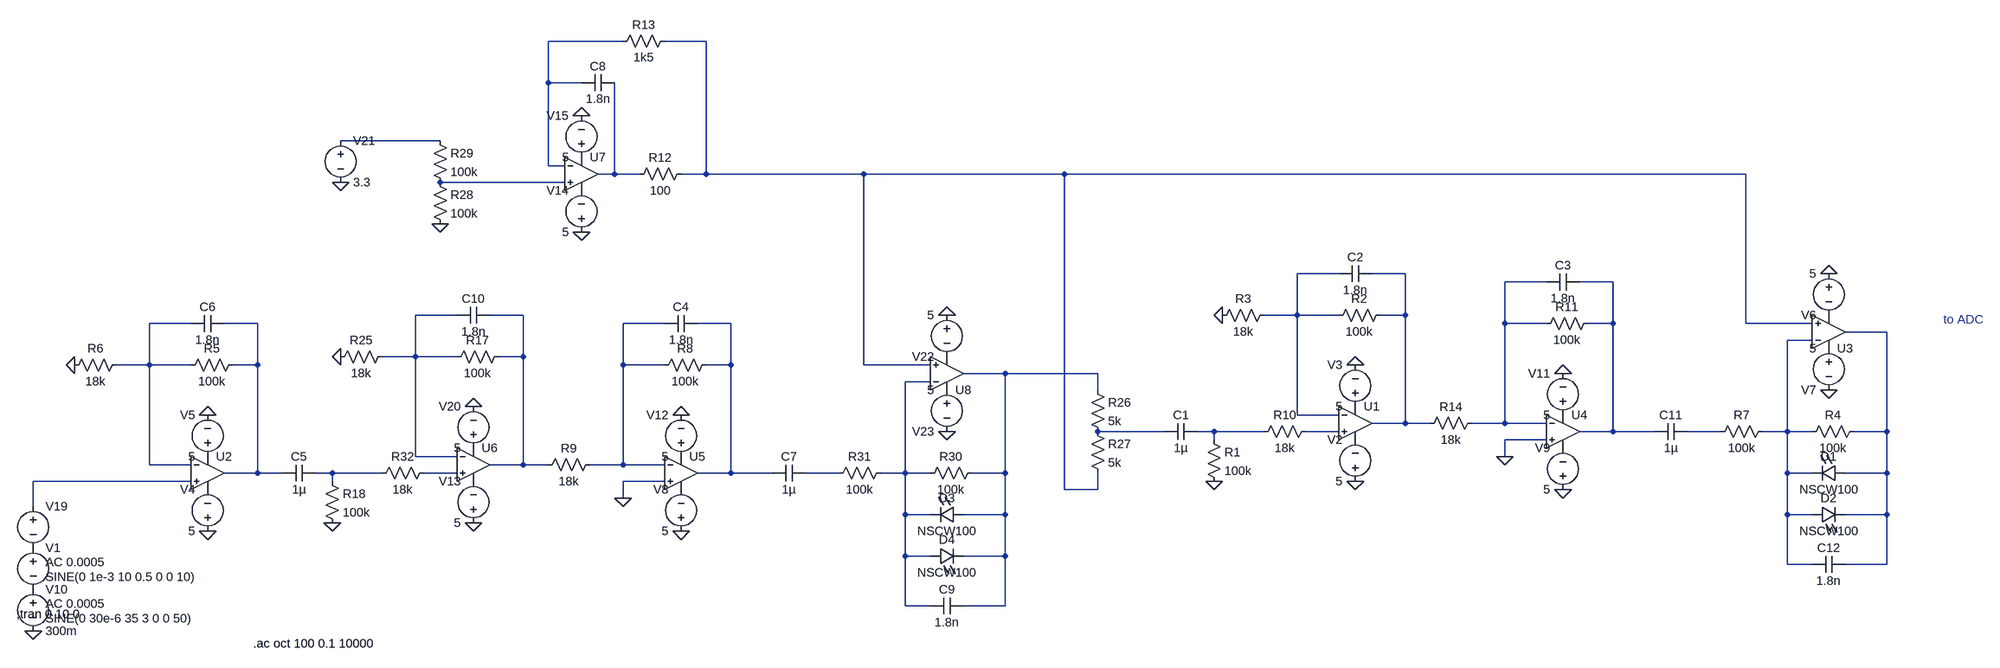
[diagram p0: schematic motion_sensor_v8.asc]
motion_sensor_v8.asc, the LTspice schematic file:
Version 4
SHEET 1 3732 1012
WIRE -480 -1072 -624 -1072
WIRE -320 -1072 -400 -1072
WIRE -624 -992 -624 -1072
WIRE -560 -992 -624 -992
WIRE -832 -880 -1024 -880
WIRE -624 -832 -624 -992
WIRE -592 -832 -624 -832
WIRE -496 -816 -496 -992
WIRE -496 -816 -528 -816
WIRE -448 -816 -496 -816
WIRE -320 -816 -320 -1072
WIRE -320 -816 -368 -816
WIRE -16 -816 -320 -816
WIRE 384 -816 -16 -816
WIRE 1696 -816 384 -816
WIRE -592 -800 -832 -800
WIRE 912 -624 832 -624
WIRE 1040 -624 976 -624
WIRE 1312 -608 1232 -608
WIRE 1440 -608 1376 -608
WIRE -800 -544 -880 -544
WIRE -672 -544 -736 -544
WIRE 832 -544 832 -624
WIRE 832 -544 768 -544
WIRE 912 -544 832 -544
WIRE 1040 -544 1040 -624
WIRE 1040 -544 992 -544
WIRE -1312 -528 -1392 -528
WIRE -1184 -528 -1248 -528
WIRE -400 -528 -480 -528
WIRE -272 -528 -336 -528
WIRE 1232 -528 1232 -608
WIRE 1312 -528 1232 -528
WIRE 1440 -528 1440 -608
WIRE 1440 -528 1392 -528
WIRE 1696 -528 1696 -816
WIRE 1824 -528 1696 -528
WIRE 1968 -512 1888 -512
WIRE 1824 -496 1776 -496
WIRE -880 -464 -880 -544
WIRE -880 -464 -944 -464
WIRE -800 -464 -880 -464
WIRE -672 -464 -672 -544
WIRE -672 -464 -720 -464
WIRE -1392 -448 -1392 -528
WIRE -1392 -448 -1456 -448
WIRE -1312 -448 -1392 -448
WIRE -1184 -448 -1184 -528
WIRE -1184 -448 -1232 -448
WIRE -480 -448 -480 -528
WIRE -400 -448 -480 -448
WIRE -272 -448 -272 -528
WIRE -272 -448 -320 -448
WIRE -16 -448 -16 -816
WIRE 112 -448 -16 -448
WIRE 256 -432 176 -432
WIRE 448 -432 256 -432
WIRE 112 -416 64 -416
WIRE 448 -400 448 -432
WIRE 832 -352 832 -544
WIRE 912 -352 832 -352
WIRE 1040 -336 1040 -544
WIRE 1040 -336 976 -336
WIRE 1088 -336 1040 -336
WIRE 1232 -336 1232 -528
WIRE 1232 -336 1168 -336
WIRE 1312 -336 1232 -336
WIRE 576 -320 448 -320
WIRE 672 -320 640 -320
WIRE 768 -320 672 -320
WIRE 912 -320 848 -320
WIRE 1440 -320 1440 -528
WIRE 1440 -320 1376 -320
WIRE 1520 -320 1440 -320
WIRE 1648 -320 1584 -320
WIRE 1776 -320 1776 -496
WIRE 1776 -320 1728 -320
WIRE 1824 -320 1776 -320
WIRE 1968 -320 1968 -512
WIRE 1968 -320 1904 -320
WIRE 672 -304 672 -320
WIRE 1312 -304 1232 -304
WIRE -880 -272 -880 -464
WIRE -800 -272 -880 -272
WIRE 1232 -272 1232 -304
WIRE -1392 -256 -1392 -448
WIRE -1312 -256 -1392 -256
WIRE -672 -256 -672 -464
WIRE -672 -256 -736 -256
WIRE -624 -256 -672 -256
WIRE -480 -256 -480 -448
WIRE -480 -256 -544 -256
WIRE -400 -256 -480 -256
WIRE -1184 -240 -1184 -448
WIRE -1184 -240 -1248 -240
WIRE -1136 -240 -1184 -240
WIRE -1040 -240 -1072 -240
WIRE -944 -240 -1040 -240
WIRE -800 -240 -864 -240
WIRE -272 -240 -272 -448
WIRE -272 -240 -336 -240
WIRE -192 -240 -272 -240
WIRE -64 -240 -128 -240
WIRE 64 -240 64 -416
WIRE 64 -240 16 -240
WIRE 112 -240 64 -240
WIRE 256 -240 256 -432
WIRE 256 -240 192 -240
WIRE 1776 -240 1776 -320
WIRE 1824 -240 1776 -240
WIRE 1968 -240 1968 -320
WIRE 1968 -240 1888 -240
WIRE -1312 -224 -1616 -224
WIRE -1040 -224 -1040 -240
WIRE -400 -224 -480 -224
WIRE 384 -208 384 -816
WIRE 448 -208 448 -240
WIRE 448 -208 384 -208
WIRE -480 -192 -480 -224
WIRE -1616 -176 -1616 -224
WIRE 64 -160 64 -240
WIRE 112 -160 64 -160
WIRE 256 -160 256 -240
WIRE 256 -160 176 -160
WIRE 1776 -160 1776 -240
WIRE 1824 -160 1776 -160
WIRE 1968 -160 1968 -240
WIRE 1968 -160 1888 -160
WIRE 64 -80 64 -160
WIRE 112 -80 64 -80
WIRE 256 -80 256 -160
WIRE 256 -80 176 -80
WIRE 1776 -64 1776 -160
WIRE 1824 -64 1776 -64
WIRE 1968 -64 1968 -160
WIRE 1968 -64 1888 -64
WIRE 64 16 64 -80
WIRE 112 16 64 16
WIRE 256 16 256 -80
WIRE 256 16 176 16
FLAG -1280 -352 0
FLAG -1280 -128 0
FLAG -1536 -448 0
FLAG -1616 64 0
FLAG -1040 -144 0
FLAG -768 -368 0
FLAG -768 -144 0
FLAG -1024 -464 0
FLAG -1024 -800 0
FLAG -832 -720 0
FLAG 144 -320 0
FLAG 144 -544 0
FLAG -368 -352 0
FLAG -368 -128 0
FLAG -480 -192 0
FLAG -560 -928 0
FLAG -560 -704 0
FLAG 672 -224 0
FLAG 944 -448 0
FLAG 944 -224 0
FLAG 688 -544 0
FLAG 1856 -400 0
FLAG 1856 -624 0
FLAG 1344 -432 0
FLAG 1344 -208 0
FLAG 1232 -272 0
SYMBOL voltage -1616 -112 R0
WINDOW 3 24 152 Left 2
WINDOW 123 24 124 Left 2
WINDOW 39 0 0 Left 2
SYMATTR Value SINE(0 30e-6 35 3 0 0 50)
SYMATTR Value2 AC 0.0005
SYMATTR InstName V1
SYMBOL Opamps\\UniversalOpamp2 -1280 -240 R0
SYMATTR InstName U2
SYMBOL voltage -1280 -112 R180
WINDOW 0 24 96 Left 2
WINDOW 3 24 16 Left 2
WINDOW 123 0 0 Left 2
WINDOW 39 0 0 Left 2
SYMATTR InstName V4
SYMATTR Value 5
SYMBOL voltage -1280 -256 R180
WINDOW 0 24 96 Left 2
WINDOW 3 24 16 Left 2
WINDOW 123 0 0 Left 2
WINDOW 39 0 0 Left 2
SYMATTR InstName V5
SYMATTR Value 5
SYMBOL res -1216 -464 R90
WINDOW 0 0 56 VBottom 2
WINDOW 3 32 56 VTop 2
SYMATTR InstName R5
SYMATTR Value 100k
SYMBOL res -1440 -464 R90
WINDOW 0 0 56 VBottom 2
WINDOW 3 32 56 VTop 2
SYMATTR InstName R6
SYMATTR Value 18k
SYMBOL cap -1248 -544 R90
WINDOW 0 0 32 VBottom 2
WINDOW 3 32 32 VTop 2
SYMATTR InstName C6
SYMATTR Value 1.8n
SYMBOL cap -1072 -256 R90
WINDOW 0 0 32 VBottom 2
WINDOW 3 32 32 VTop 2
SYMATTR InstName C5
SYMATTR Value 1µ
SYMBOL voltage -1616 -32 R0
WINDOW 123 0 0 Left 2
WINDOW 39 0 0 Left 2
SYMATTR InstName V10
SYMATTR Value 300m
SYMBOL res -1056 -240 R0
SYMATTR InstName R18
SYMATTR Value 100k
SYMBOL voltage -1616 -192 R0
WINDOW 3 24 152 Left 2
WINDOW 123 24 124 Left 2
WINDOW 39 0 0 Left 2
SYMATTR Value SINE(0 1e-3 10 0.5 0 0 10)
SYMATTR Value2 AC 0.0005
SYMATTR InstName V19
SYMBOL Opamps\\UniversalOpamp2 -768 -256 R0
SYMATTR InstName U6
SYMBOL voltage -768 -128 R180
WINDOW 0 24 96 Left 2
WINDOW 3 24 16 Left 2
WINDOW 123 0 0 Left 2
WINDOW 39 0 0 Left 2
SYMATTR InstName V13
SYMATTR Value 5
SYMBOL voltage -768 -272 R180
WINDOW 0 24 96 Left 2
WINDOW 3 24 16 Left 2
WINDOW 123 0 0 Left 2
WINDOW 39 0 0 Left 2
SYMATTR InstName V20
SYMATTR Value 5
SYMBOL res -704 -480 R90
WINDOW 0 0 56 VBottom 2
WINDOW 3 32 56 VTop 2
SYMATTR InstName R17
SYMATTR Value 100k
SYMBOL res -928 -480 R90
WINDOW 0 0 56 VBottom 2
WINDOW 3 32 56 VTop 2
SYMATTR InstName R25
SYMATTR Value 18k
SYMBOL cap -736 -560 R90
WINDOW 0 0 32 VBottom 2
WINDOW 3 32 32 VTop 2
SYMATTR InstName C10
SYMATTR Value 1.8n
SYMBOL res 432 -416 R0
SYMATTR InstName R26
SYMATTR Value 5k
SYMBOL res 432 -336 R0
SYMATTR InstName R27
SYMATTR Value 5k
SYMBOL voltage -1024 -896 R0
WINDOW 123 0 0 Left 2
WINDOW 39 0 0 Left 2
SYMATTR InstName V21
SYMATTR Value 3.3
SYMBOL res -848 -816 R0
SYMATTR InstName R28
SYMATTR Value 100k
SYMBOL res -848 -896 R0
SYMATTR InstName R29
SYMATTR Value 100k
SYMBOL Opamps\\UniversalOpamp2 144 -432 M180
SYMATTR InstName U8
SYMBOL voltage 144 -560 M0
WINDOW 0 24 96 Left 2
WINDOW 3 24 16 Left 2
WINDOW 123 0 0 Left 2
WINDOW 39 0 0 Left 2
SYMATTR InstName V22
SYMATTR Value 5
SYMBOL voltage 144 -416 M0
WINDOW 0 24 96 Left 2
WINDOW 3 24 16 Left 2
WINDOW 123 0 0 Left 2
WINDOW 39 0 0 Left 2
SYMATTR InstName V23
SYMATTR Value 5
SYMBOL res 208 -256 R90
WINDOW 0 0 56 VBottom 2
WINDOW 3 32 56 VTop 2
SYMATTR InstName R30
SYMATTR Value 100k
SYMBOL res 32 -256 R90
WINDOW 0 0 56 VBottom 2
WINDOW 3 32 56 VTop 2
SYMATTR InstName R31
SYMATTR Value 100k
SYMBOL res -848 -256 R90
WINDOW 0 0 56 VBottom 2
WINDOW 3 32 56 VTop 2
SYMATTR InstName R32
SYMATTR Value 18k
SYMBOL Opamps\\UniversalOpamp2 -368 -240 R0
SYMATTR InstName U5
SYMBOL voltage -368 -112 R180
WINDOW 0 24 96 Left 2
WINDOW 3 24 16 Left 2
WINDOW 123 0 0 Left 2
WINDOW 39 0 0 Left 2
SYMATTR InstName V8
SYMATTR Value 5
SYMBOL voltage -368 -256 R180
WINDOW 0 24 96 Left 2
WINDOW 3 24 16 Left 2
WINDOW 123 0 0 Left 2
WINDOW 39 0 0 Left 2
SYMATTR InstName V12
SYMATTR Value 5
SYMBOL res -304 -464 R90
WINDOW 0 0 56 VBottom 2
WINDOW 3 32 56 VTop 2
SYMATTR InstName R8
SYMATTR Value 100k
SYMBOL cap -336 -544 R90
WINDOW 0 0 32 VBottom 2
WINDOW 3 32 32 VTop 2
SYMATTR InstName C4
SYMATTR Value 1.8n
SYMBOL res -640 -240 R270
WINDOW 0 32 56 VTop 2
WINDOW 3 0 56 VBottom 2
SYMATTR InstName R9
SYMATTR Value 18k
SYMBOL cap -128 -256 R90
WINDOW 0 0 32 VBottom 2
WINDOW 3 32 32 VTop 2
SYMATTR InstName C7
SYMATTR Value 1µ
SYMBOL Opamps\\UniversalOpamp2 -560 -816 R0
SYMATTR InstName U7
SYMBOL voltage -560 -688 R180
WINDOW 0 24 96 Left 2
WINDOW 3 24 16 Left 2
WINDOW 123 0 0 Left 2
WINDOW 39 0 0 Left 2
SYMATTR InstName V14
SYMATTR Value 5
SYMBOL voltage -560 -832 R180
WINDOW 0 24 96 Left 2
WINDOW 3 24 16 Left 2
WINDOW 123 0 0 Left 2
WINDOW 39 0 0 Left 2
SYMATTR InstName V15
SYMATTR Value 5
SYMBOL cap -496 -1008 R90
WINDOW 0 0 32 VBottom 2
WINDOW 3 32 32 VTop 2
SYMATTR InstName C8
SYMATTR Value 1.8n
SYMBOL res -352 -832 R90
WINDOW 0 0 56 VBottom 2
WINDOW 3 32 56 VTop 2
SYMATTR InstName R12
SYMATTR Value 100
SYMBOL res -384 -1088 R90
WINDOW 0 0 56 VBottom 2
WINDOW 3 32 56 VTop 2
SYMATTR InstName R13
SYMATTR Value 1k5
SYMBOL LED 176 -176 R90
WINDOW 0 0 32 VBottom 2
WINDOW 3 32 32 VTop 2
SYMATTR InstName D3
SYMATTR Value NSCW100
SYMATTR Description Diode
SYMATTR Type diode
SYMBOL LED 112 -64 R270
WINDOW 0 32 32 VTop 2
WINDOW 3 0 32 VBottom 2
SYMATTR InstName D4
SYMATTR Value NSCW100
SYMATTR Description Diode
SYMATTR Type diode
SYMBOL cap 176 0 R90
WINDOW 0 0 32 VBottom 2
WINDOW 3 32 32 VTop 2
SYMATTR InstName C9
SYMATTR Value 1.8n
SYMBOL cap 640 -336 R90
WINDOW 0 0 32 VBottom 2
WINDOW 3 32 32 VTop 2
SYMATTR InstName C1
SYMATTR Value 1µ
SYMBOL res 656 -320 R0
SYMATTR InstName R1
SYMATTR Value 100k
SYMBOL Opamps\\UniversalOpamp2 944 -336 R0
SYMATTR InstName U1
SYMBOL voltage 944 -208 R180
WINDOW 0 24 96 Left 2
WINDOW 3 24 16 Left 2
WINDOW 123 0 0 Left 2
WINDOW 39 0 0 Left 2
SYMATTR InstName V2
SYMATTR Value 5
SYMBOL voltage 944 -352 R180
WINDOW 0 24 96 Left 2
WINDOW 3 24 16 Left 2
WINDOW 123 0 0 Left 2
WINDOW 39 0 0 Left 2
SYMATTR InstName V3
SYMATTR Value 5
SYMBOL res 1008 -560 R90
WINDOW 0 0 56 VBottom 2
WINDOW 3 32 56 VTop 2
SYMATTR InstName R2
SYMATTR Value 100k
SYMBOL res 784 -560 R90
WINDOW 0 0 56 VBottom 2
WINDOW 3 32 56 VTop 2
SYMATTR InstName R3
SYMATTR Value 18k
SYMBOL cap 976 -640 R90
WINDOW 0 0 32 VBottom 2
WINDOW 3 32 32 VTop 2
SYMATTR InstName C2
SYMATTR Value 1.8n
SYMBOL Opamps\\UniversalOpamp2 1856 -512 M180
SYMATTR InstName U3
SYMBOL voltage 1856 -640 M0
WINDOW 0 24 96 Left 2
WINDOW 3 24 16 Left 2
WINDOW 123 0 0 Left 2
WINDOW 39 0 0 Left 2
SYMATTR InstName V6
SYMATTR Value 5
SYMBOL voltage 1856 -496 M0
WINDOW 0 24 96 Left 2
WINDOW 3 24 16 Left 2
WINDOW 123 0 0 Left 2
WINDOW 39 0 0 Left 2
SYMATTR InstName V7
SYMATTR Value 5
SYMBOL res 1920 -336 R90
WINDOW 0 0 56 VBottom 2
WINDOW 3 32 56 VTop 2
SYMATTR InstName R4
SYMATTR Value 100k
SYMBOL res 1744 -336 R90
WINDOW 0 0 56 VBottom 2
WINDOW 3 32 56 VTop 2
SYMATTR InstName R7
SYMATTR Value 100k
SYMBOL res 864 -336 R90
WINDOW 0 0 56 VBottom 2
WINDOW 3 32 56 VTop 2
SYMATTR InstName R10
SYMATTR Value 18k
SYMBOL Opamps\\UniversalOpamp2 1344 -320 R0
SYMATTR InstName U4
SYMBOL voltage 1344 -192 R180
WINDOW 0 24 96 Left 2
WINDOW 3 24 16 Left 2
WINDOW 123 0 0 Left 2
WINDOW 39 0 0 Left 2
SYMATTR InstName V9
SYMATTR Value 5
SYMBOL voltage 1344 -336 R180
WINDOW 0 24 96 Left 2
WINDOW 3 24 16 Left 2
WINDOW 123 0 0 Left 2
WINDOW 39 0 0 Left 2
SYMATTR InstName V11
SYMATTR Value 5
SYMBOL res 1408 -544 R90
WINDOW 0 0 56 VBottom 2
WINDOW 3 32 56 VTop 2
SYMATTR InstName R11
SYMATTR Value 100k
SYMBOL cap 1376 -624 R90
WINDOW 0 0 32 VBottom 2
WINDOW 3 32 32 VTop 2
SYMATTR InstName C3
SYMATTR Value 1.8n
SYMBOL res 1072 -320 R270
WINDOW 0 32 56 VTop 2
WINDOW 3 0 56 VBottom 2
SYMATTR InstName R14
SYMATTR Value 18k
SYMBOL cap 1584 -336 R90
WINDOW 0 0 32 VBottom 2
WINDOW 3 32 32 VTop 2
SYMATTR InstName C11
SYMATTR Value 1µ
SYMBOL LED 1888 -256 R90
WINDOW 0 0 32 VBottom 2
WINDOW 3 32 32 VTop 2
SYMATTR InstName D1
SYMATTR Value NSCW100
SYMATTR Description Diode
SYMATTR Type diode
SYMBOL LED 1824 -144 R270
WINDOW 0 32 32 VTop 2
WINDOW 3 0 32 VBottom 2
SYMATTR InstName D2
SYMATTR Value NSCW100
SYMATTR Description Diode
SYMATTR Type diode
SYMBOL cap 1888 -80 R90
WINDOW 0 0 32 VBottom 2
WINDOW 3 32 32 VTop 2
SYMATTR InstName C12
SYMATTR Value 1.8n
TEXT -1648 32 Left 2 !;tran 0 10 0
TEXT -1192 88 Left 2 !.ac oct 100 0.1 10000
TEXT 2280 -536 Left 2 ;to ADC

The netlist it stands for:
* motion_sensor_v8.asc
V1 P001 P002 SINE(0 30e-6 35 3 0 0 50) AC 0.0005
XU2 N027 N012 P003 P004 N013 level.2 Avol=1Meg GBW=10Meg Slew=10Meg ilimit=25m rail=0 Vos=0 phimargin=45 en=0 enk=0 in=0 ink=0 Rin=500Meg  ; pins IN+ IN- V+ V- OUT
V4 0 P004 5
V5 P003 0 5
R5 N013 N012 100k
R6 N012 0 18k
C6 N013 N012 1.8n
C5 N024 N013 1µ
V10 P002 0 300m
R18 N024 0 100k
V19 N027 P001 SINE(0 1e-3 10 0.5 0 0 10) AC 0.0005
XU6 N025 N010 P005 P006 N011 level.2 Avol=1Meg GBW=10Meg Slew=10Meg ilimit=25m rail=0 Vos=0 phimargin=45 en=0 enk=0 in=0 ink=0 Rin=500Meg  ; pins IN+ IN- V+ V- OUT
V13 0 P006 5
V20 P005 0 5
R17 N011 N010 100k
R25 N010 0 18k
C10 N011 N010 1.8n
R26 N018 N020 5k
R27 N020 N002 5k
V21 N003 0 3.3
R28 N005 0 100k
R29 N003 N005 100k
XU8 N002 N019 P007 P008 N018 level.2 Avol=1Meg GBW=10Meg Slew=10Meg ilimit=25m rail=0 Vos=0 phimargin=45 en=0 enk=0 in=0 ink=0 Rin=500Meg  ; pins IN+ IN- V+ V- OUT
V22 0 P008 5
V23 P007 0 5
R30 N018 N019 100k
R31 N019 N026 100k
R32 N025 N024 18k
XU5 0 N014 P009 P010 N015 level.2 Avol=1Meg GBW=10Meg Slew=10Meg ilimit=25m rail=0 Vos=0 phimargin=45 en=0 enk=0 in=0 ink=0 Rin=500Meg  ; pins IN+ IN- V+ V- OUT
V8 0 P010 5
V12 P009 0 5
R8 N015 N014 100k
C4 N015 N014 1.8n
R9 N011 N014 18k
C7 N026 N015 1µ
XU7 N005 N001 P011 P012 N004 level.2 Avol=1Meg GBW=10Meg Slew=10Meg ilimit=25m rail=0 Vos=0 phimargin=45 en=0 enk=0 in=0 ink=0 Rin=500Meg  ; pins IN+ IN- V+ V- OUT
V14 0 P012 5
V15 P011 0 5
C8 N004 N001 1.8n
R12 N002 N004 100
R13 N002 N001 1k5
D3 N018 N019 NSCW100
D4 N019 N018 NSCW100
C9 N018 N019 1.8n
C1 N021 N020 1µ
R1 N021 0 100k
XU1 N022 N006 P013 P014 N007 level.2 Avol=1Meg GBW=10Meg Slew=10Meg ilimit=25m rail=0 Vos=0 phimargin=45 en=0 enk=0 in=0 ink=0 Rin=500Meg  ; pins IN+ IN- V+ V- OUT
V2 0 P014 5
V3 P013 0 5
R2 N007 N006 100k
R3 N006 0 18k
C2 N007 N006 1.8n
XU3 N002 N017 P015 P016 N016 level.2 Avol=1Meg GBW=10Meg Slew=10Meg ilimit=25m rail=0 Vos=0 phimargin=45 en=0 enk=0 in=0 ink=0 Rin=500Meg  ; pins IN+ IN- V+ V- OUT
V6 0 P016 5
V7 P015 0 5
R4 N016 N017 100k
R7 N017 N023 100k
R10 N022 N021 18k
XU4 0 N008 P017 P018 N009 level.2 Avol=1Meg GBW=10Meg Slew=10Meg ilimit=25m rail=0 Vos=0 phimargin=45 en=0 enk=0 in=0 ink=0 Rin=500Meg  ; pins IN+ IN- V+ V- OUT
V9 0 P018 5
V11 P017 0 5
R11 N009 N008 100k
C3 N009 N008 1.8n
R14 N007 N008 18k
C11 N023 N009 1µ
D1 N016 N017 NSCW100
D2 N017 N016 NSCW100
C12 N016 N017 1.8n
.model D D
.lib standard.dio
;tran 0 10 0
.ac oct 100 0.1 10000
* to ADC
.lib UniversalOpamps2.sub
.backanno
.end